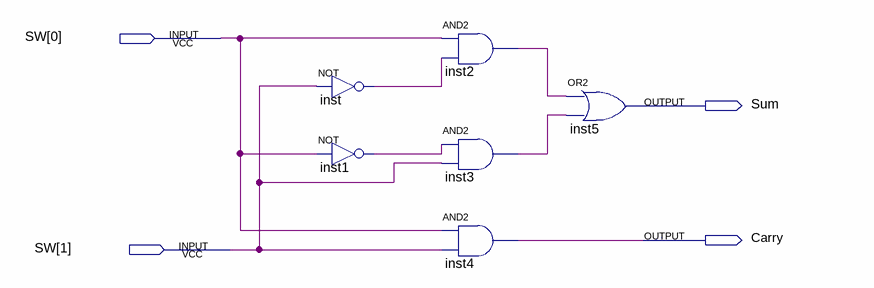
[diagram p0: schematic sheet]
// Quartus schematic half_adder.bdf as structural Verilog: 6 symbols, 4 pins
module half_adder (
  input  [1:0] SW,
  output Sum,
  output Carry
);

  wire inst1_out, inst2_out, inst3_out, inst_out;

  not inst (inst_out, SW[1]);
  not inst1 (inst1_out, SW[0]);
  and inst2 (inst2_out, SW[0], inst_out);
  and inst3 (inst3_out, inst1_out, SW[1]);
  and inst4 (Carry, SW[0], SW[1]);
  or inst5 (Sum, inst2_out, inst3_out);
endmodule
